# Altium schematic sheet DС-DC_5.5-36V_5A_Filtered.SchDoc
size A4
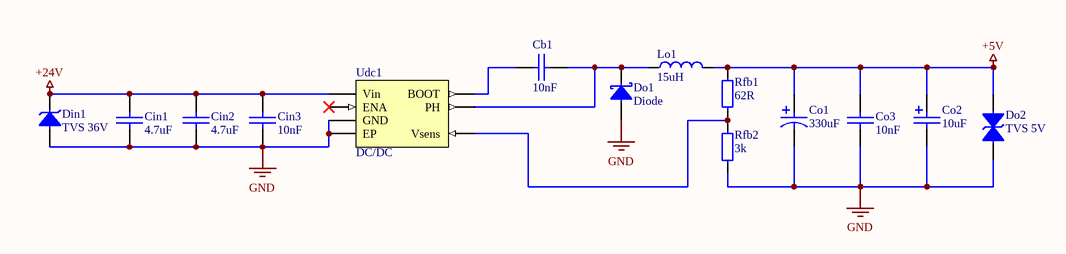
[diagram p0: DС-DC_5.5-36V_5A_Filtered.SchDoc]

## Parts
Cb1  10nF  [1206 Capacitor]
Cin1  4.7uF  [1206 Capacitor]
Cin2  4.7uF  [1206 Capacitor]
Cin3  10nF  [1206 Capacitor]
Co1  330uF  [Bar Cap 8x10.5]
Co2  10uF  [TANTAL_A_CASE]
Co3  10nF  [1206 Capacitor]
Din1  TVS 36V  [SMB]
Do1  Diode  [SMB]
Do2  TVS 5V  [sod-323]
Lo1  15uH  [Inductor 7x7]
Rfb1  62R  [0603 Resistor]
Rfb2  3k  [0603 Resistor]
Udc1  DC/DC  [HSOP-8]

## Nets
+5V: Co1.2 Co2.2 Co3.2 Do2.2 Lo1.2 Rfb1.2
+24V: Cin1.2 Cin2.2 Cin3.2 Din1.2 Udc1.7(Vin)
GND: Cin1.1 Cin2.1 Cin3.1 Co1.1 Co2.1 Co3.1 Din1.1 Do1.1 Do2.1 Rfb2.1 Udc1.6(GND) Udc1.A(EP)
NetCb1_1: Cb1.1 Do1.2 Lo1.1 Udc1.8(PH)
NetCb1_2: Cb1.2 Udc1.1(BOOT)
NetRfb1_1: Rfb1.1 Rfb2.2 Udc1.4(Vsens)

Not connected (* = marked no-connect by the designer): Udc1 5(ENA)*

## Library data of the parts
Cb1 Cin3 Co3 = Cap 10nF (1206): 10nF X7R 10% 50V 1206; Manufacturer: Murata Manufacturing; Part Number: GRM319R71H103KA01D; Type: Capacitor; ComponentLink1Description: Chip&Dip; ComponentLink1URL: https://www.chipdip.ru/product/grm319r71h103k
Cin1 Cin2 = Cap 4.7uF (1206): 4.7uF X7R 10% 50V 1206; Manufacturer: Murata Manufacturing; Part Number: GRM31CR71H475KA12L; Type: Capacitor; ComponentLink1Description: Chip&Dip; ComponentLink1URL: https://www.chipdip.ru/product/grm31cr71h475ka12l
Co1 = Cap Pol 330uF: ECAP SMD,  16V, 105°C, 20%; Part Number: JCK1C331M080105; Manufacturer: JB; Type: Capacitor; ComponentLink1Description: Chip&Dip; ComponentLink1URL: https://www.chipdip.ru/product0/9000565746
Co2 = Cap Tantal 10uF (SMDA): TECAP, 10uF, 16V, case A, 10%; Part Number: 373033076; Manufacturer: China; Type: Capacitor; ComponentLink1Description: Chip&Dip; ComponentLink1URL: https://www.chipdip.ru/product0/373033076
Din1 = TVS Diode 36V [SM6T]: 600W; Part Number: SM6T36CA; Manufacturer: STMicroelectronics; Type: Diode; ComponentLink1Description: DataSheet; ComponentLink1URL: https://static6.arrow.com/aropdfconversion/2bbceae9338c8edef500ca51dc612d5485c99b0/80725453396644cd000.pdf; ComponentLink2Description: Chip&Dip; ComponentLink2URL: https://www.chipdip.ru/product/sm6t36ca
Do1 = Diode Schottky (SMB) [SK54]: Diode Schottky 5A 40V; Part Number: SK54; Manufacturer: Diotec Semiconductor; Type: Diode; ComponentLink1Description: DataSheet; ComponentLink1URL: https://static.chipdip.ru/lib/092/DOC001092363.pdf; ComponentLink2Description: Chip&Dip; ComponentLink2URL: https://www.chipdip.ru/product/sk54
Do2 = TVS Diode 5V [PESD]: ESD Suppressor TVS 30KV,130W,  SOD-323; Part Number: PESD5V0S1BA,115; Manufacturer: Nexperia; Type: Diode; ComponentLink1Description: DataSheet; ComponentLink1URL: https://static.chipdip.ru/lib/160/DOC001160262.pdf; ComponentLink2Description: Chip&Dip; ComponentLink2URL: https://www.chipdip.ru/product/pesd5v0s1ba.115
Lo1 = Inductor 15uH (0.2..3.6A): 15uH, 1.53A, 7X7; Part Number: B82472G6153M000; Manufacturer: Epcos; Type: Inductor; ComponentLink1Description: DataSheet; ComponentLink1URL: https://static.chipdip.ru/lib/972/DOC003972643.pdf; ComponentLink2Description: Chip&Dip; ComponentLink2URL: https://www.chipdip.ru/product/b82472g6153m000-15
Rfb1 = Res 62R (0603): 0.1W 0603 62R, 1%; Part Number: RC0603FR-0762RL; Manufacturer: Taiwan; Type: Resistor; ComponentLink1Description: Chip&Dip; ComponentLink1URL: https://www.chipdip.ru/product0/9000079611
Rfb2 = Res 3k (0603): 0.1W 0603 3k, 1%; Part Number: RC0603FR-073KL; Manufacturer: Taiwan; Type: Resistor; ComponentLink1Description: Chip&Dip; ComponentLink1URL: https://www.chipdip.ru/product0/9000079723
Udc1 = DC/DC Controller [TPS54]: The TPS5450 is  a  high-output-current PWM converter that integrates a low-resistance, high-side N-channel MOSFET; Manufacturer: Texas Instruments; Part Number: TPS5450DDAR; ComponentLink1Description: Chip&Dip; ComponentLink1URL: https://www.chipdip.ru/product/tps5450ddar-2; ComponentLink2Description: DataSheet; ComponentLink2URL: https://static.chipdip.ru/lib/787/DOC004787015.pdf; Type: IC